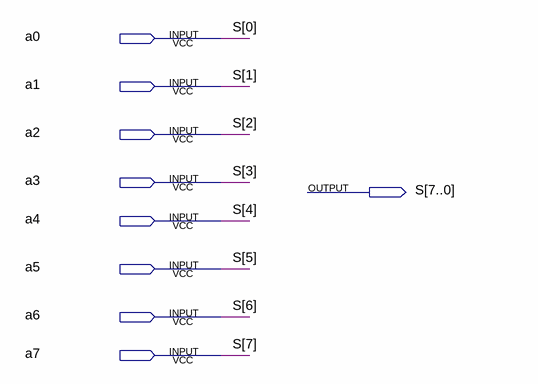
[diagram p0: schematic sheet]
// Quartus schematic BusEncoder8.bdf as structural Verilog: 0 symbols, 9 pins
module BusEncoder8 (
  input  a0,
  input  a1,
  input  a2,
  input  a3,
  input  a4,
  input  a5,
  input  a6,
  input  a7,
  output [7:0] S
);


  assign S = {a7, a6, a5, a4, a3, a2, a1, a0};
endmodule
